# EAGLE design USB_PocketBeagle (EAGLE 8.5.1)
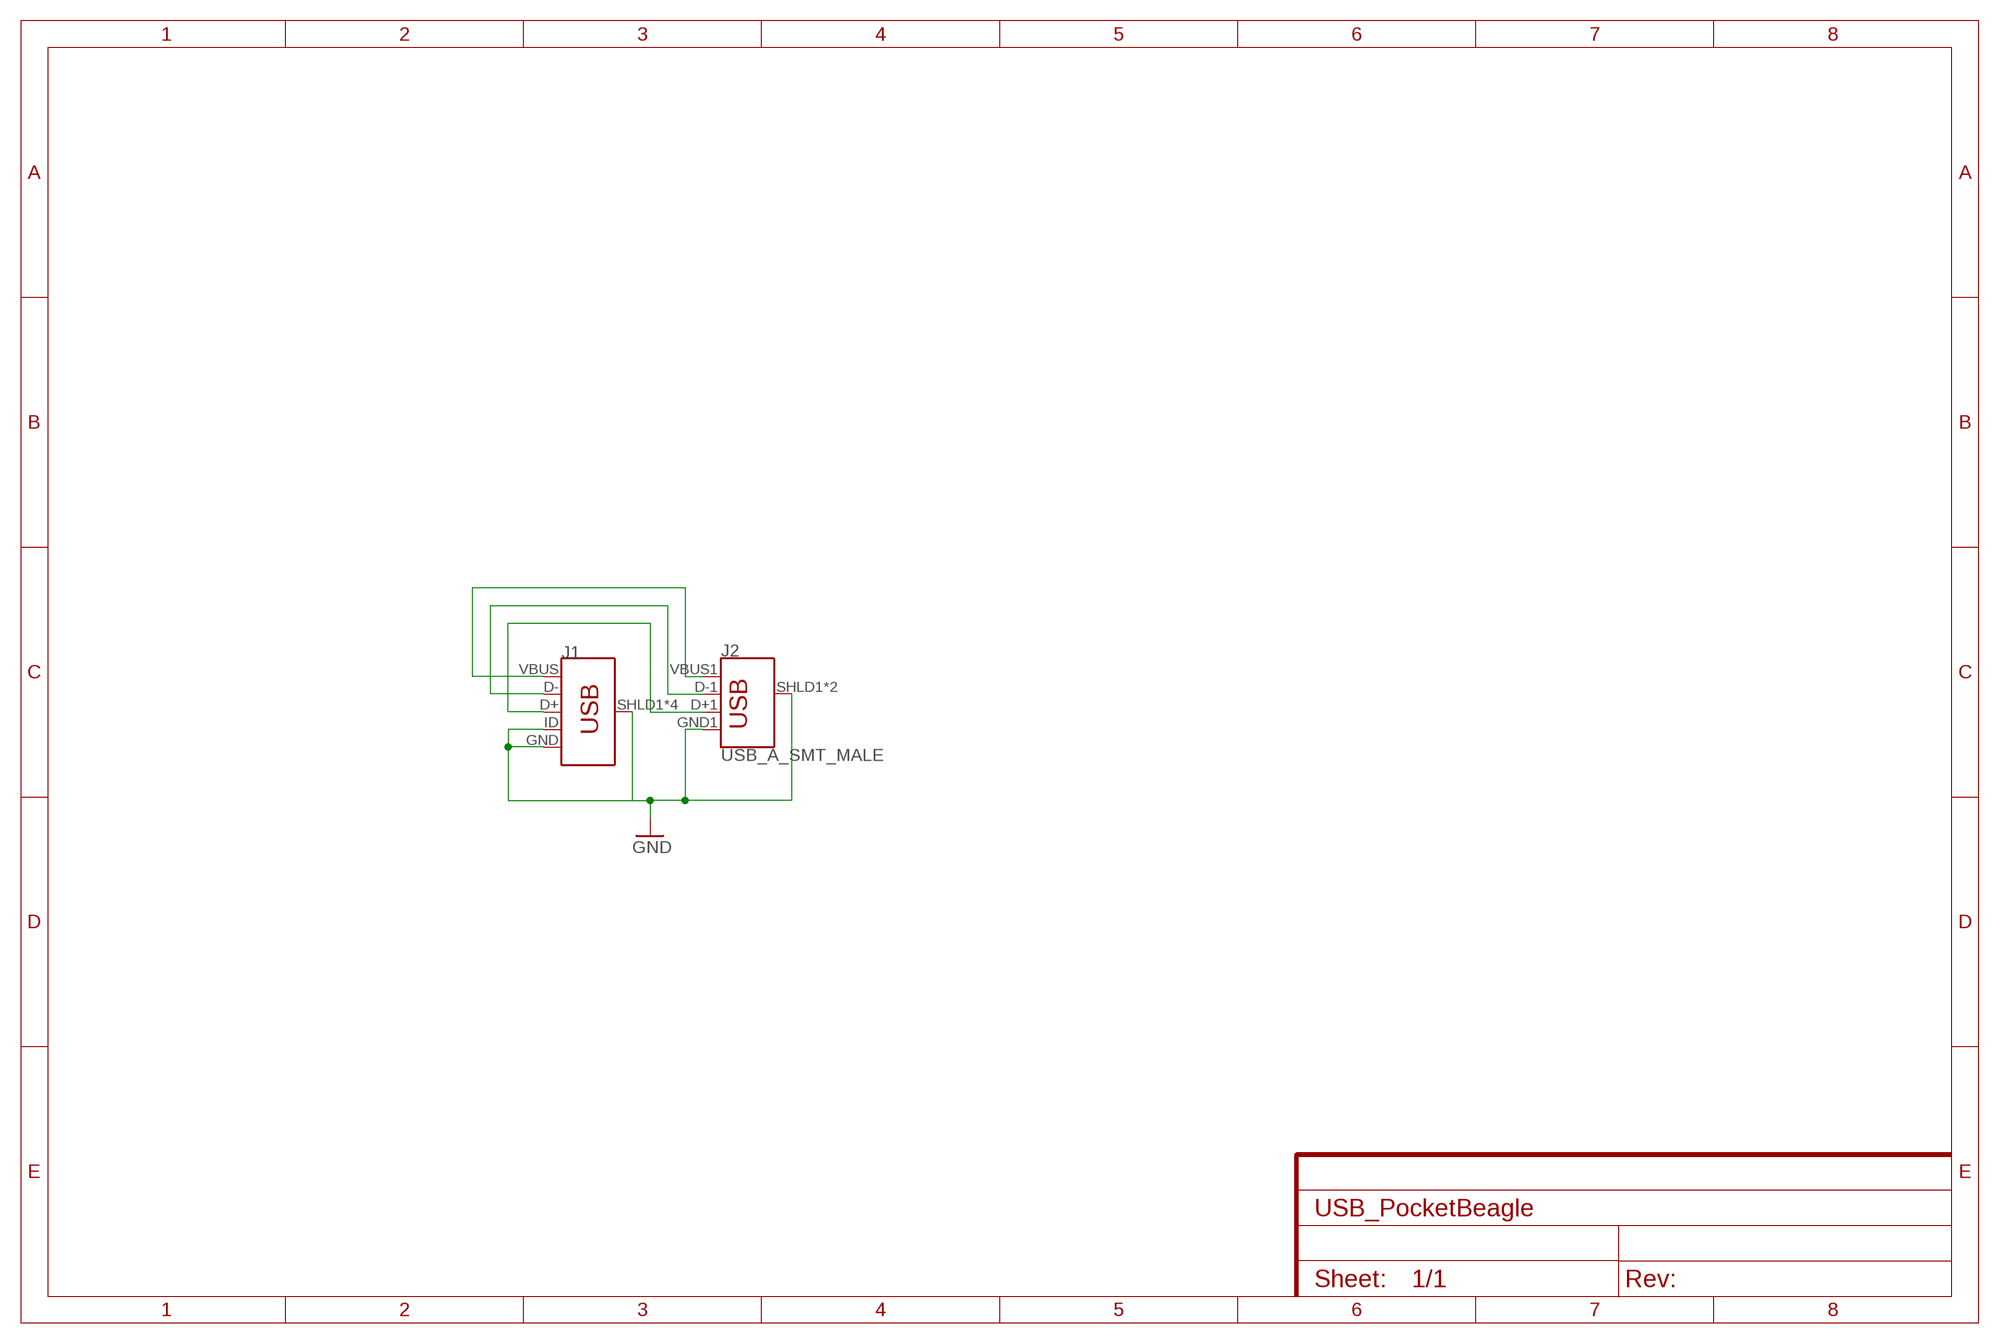
[diagram p0: schematic, sheet 1]

## Parts
J1  USB_MICRO-B_MALE-VERT  [USB_MICROB_VERTICAL]
J2  USB_A_SMT_MALE  [USB-A-SMT-MALE]

## Nets
GND: J1.GND J1.ID J1.SHLD1(SHIELD) J1.SHLD2(SHIELD) J1.SHLD3(SHIELD) J1.SHLD4(SHIELD) J2.GND1(GND) J2.SHLD1(SHIELD) J2.SHLD2(SHIELD)
N$1: J1.VBUS J2.VBUS1(VBUS)
N$2: J1.D- J2.D-1(D-)
N$3: J1.D+ J2.D+1(D+)

## Library data of the parts
J1 = SparkFun-Connectors:USB_MICRO-B: USB Type Micro-B Connector Male/female and PTH/SMT variants SparkFun Products: SparkFun microB USB Breakout <https://www.sparkfun.com/products/12035> SparkFun USB microB Plug Breakout <https://www.sparkfun.com/products/10031> SparkFun ESP8266 Thing <https://www.sparkfun.com/products/13231>; PROD_ID: CONN-09900
J2 = SparkFun-Connectors:USB_A: USB-A Connector Male and female variants, as well as PTH and SMT variants SparkFun Products: SparkFun XBee Explorer Dongle <https://www.sparkfun.com/products/11697> PTH Male SparkFun MicroView-USB Programmer <https://www.sparkfun.com/products/12924> SMT Male SparkFun USB Type A Female Breakout <https://www.sparkfun.com/products/12700> SMT Female; PROD_ID: CONN-11499

## Board
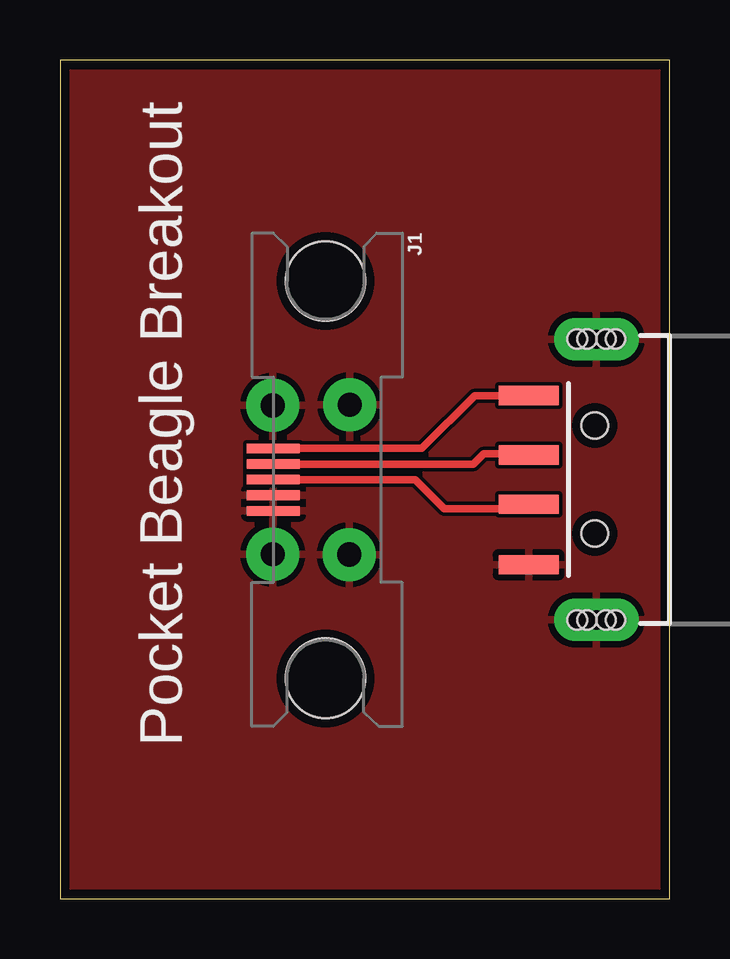
[diagram p1: board, top side]
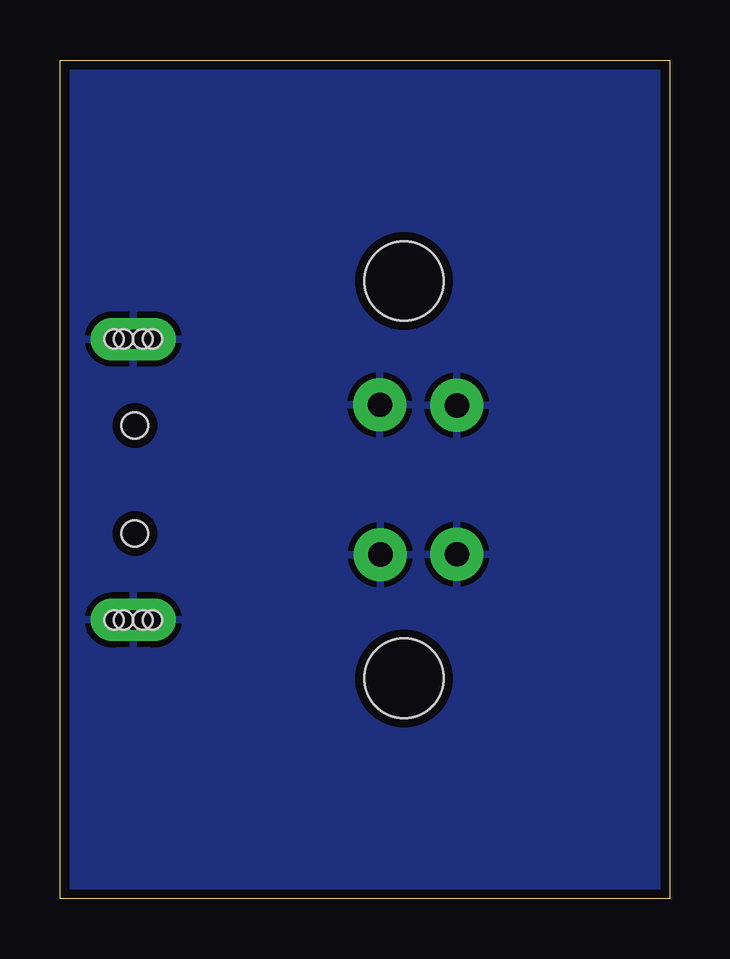
[diagram p2: board, bottom side, seen from below]

Size 25.4 x 34.95 mm. Coordinates in mm from the lower left corner, seen from the top.
Outline: 0,0 25.4,0 25.4,34.95 0,34.95 0,0
Copper layers (1*16): Top 0.035559375mm / dielectric 1.6mm / Bottom 0.035559375mm
Design rules "oshpark-2layer": minimum track width 6mil, minimum drill 10mil, track to track 6mil, track to pad 6mil, pad to pad 6mil, via to via 6mil, smd to smd 6mil, copper to edge 15mil, drill to drill 6mil, minimum pad ring 5mil, minimum via ring 5mil, stop-mask expansion 2.5mil, vias tented up to drill 0mil, thermal gap 10mil

### Footprints (pad centres in the part's own frame; a part is rotated, then mirrored left to right if it is on the bottom)
USB_MICROB_VERTICAL = smd 0.4 x 2.2: D+ 0,0; D- -0.65,0; GND 1.3,0; ID 0.65,0; VBUS -1.3,0 | drill 1.016 pad 2.2: SHLD1 -3.121,3.183; SHLD2 3.122,3.16; SHLD3 -3.098,-0.027; SHLD4 3.108,-0.026 | hole 3.3: -8.275,2.17; 8.275,2.17
USB-A-SMT-MALE = smd 2.5 x 0.8: D+1 10.95,1.027; D-1 10.95,-1.027; GND1 10.95,3.551; VBUS1 10.95,-3.5 | drill 0.8 pad 1.778 long: SHLD1 8.13,-5.85; SHLD2 8.13,5.85 | hole 1.1: 8.2,2.25; 8.2,-2.25 | hole 0.8: 8.53,-5.85; 8.93,-5.85; 7.73,-5.85; 7.33,-5.85; 8.53,5.85; 8.93,5.85; 7.73,5.85; 7.33,5.85

### Placement (x,y rotation side)
J1  8.89,17.46 270 top
J2  30.48,17.47 180 top

### Tracks (layer width: path | path; a pad name or v marks a point on that pad's centre or on a via)
GND
  pour Top: 0,0 0,34.92 25.4,34.92 25.4,0
  pour Bottom: 0,0 0,34.92 25.4,34.92 25.4,0
N$1
  Top 0.305: J1.VBUS 15.08,18.76 17.29,20.97 J2.VBUS1
N$2
  Top 0.305: J1.D- 17.22,18.11 17.65,18.54 19.48,18.54 J2.D-1
N$3
  Top 0.305: J1.D+ 14.8,17.46 16,16.26 19.34,16.26 J2.D+1

### Text on the board
tPlace: Pocket Beagle Breakout